# Altium schematic sheet USB-Debug.SchDoc
size A3; SheetNumber: 1; SheetTotal: 1; PageSetup: Record=PageOptions|CenterHorizontal=True|CenterVertical=True|PrintScale=0.97|XCorrection=1.00|YCorrection=1.00|PrintKind=1|BorderSize=5000000|LeftOffset=0|BottomOffset=0|Orientation=2|PaperLength=2970|PaperWidth=2100|Scale=100|PaperSource=7|PrintQuality=600|MediaType=1|DitherType=10|PaperKind=A4|PrintScaleMode=1
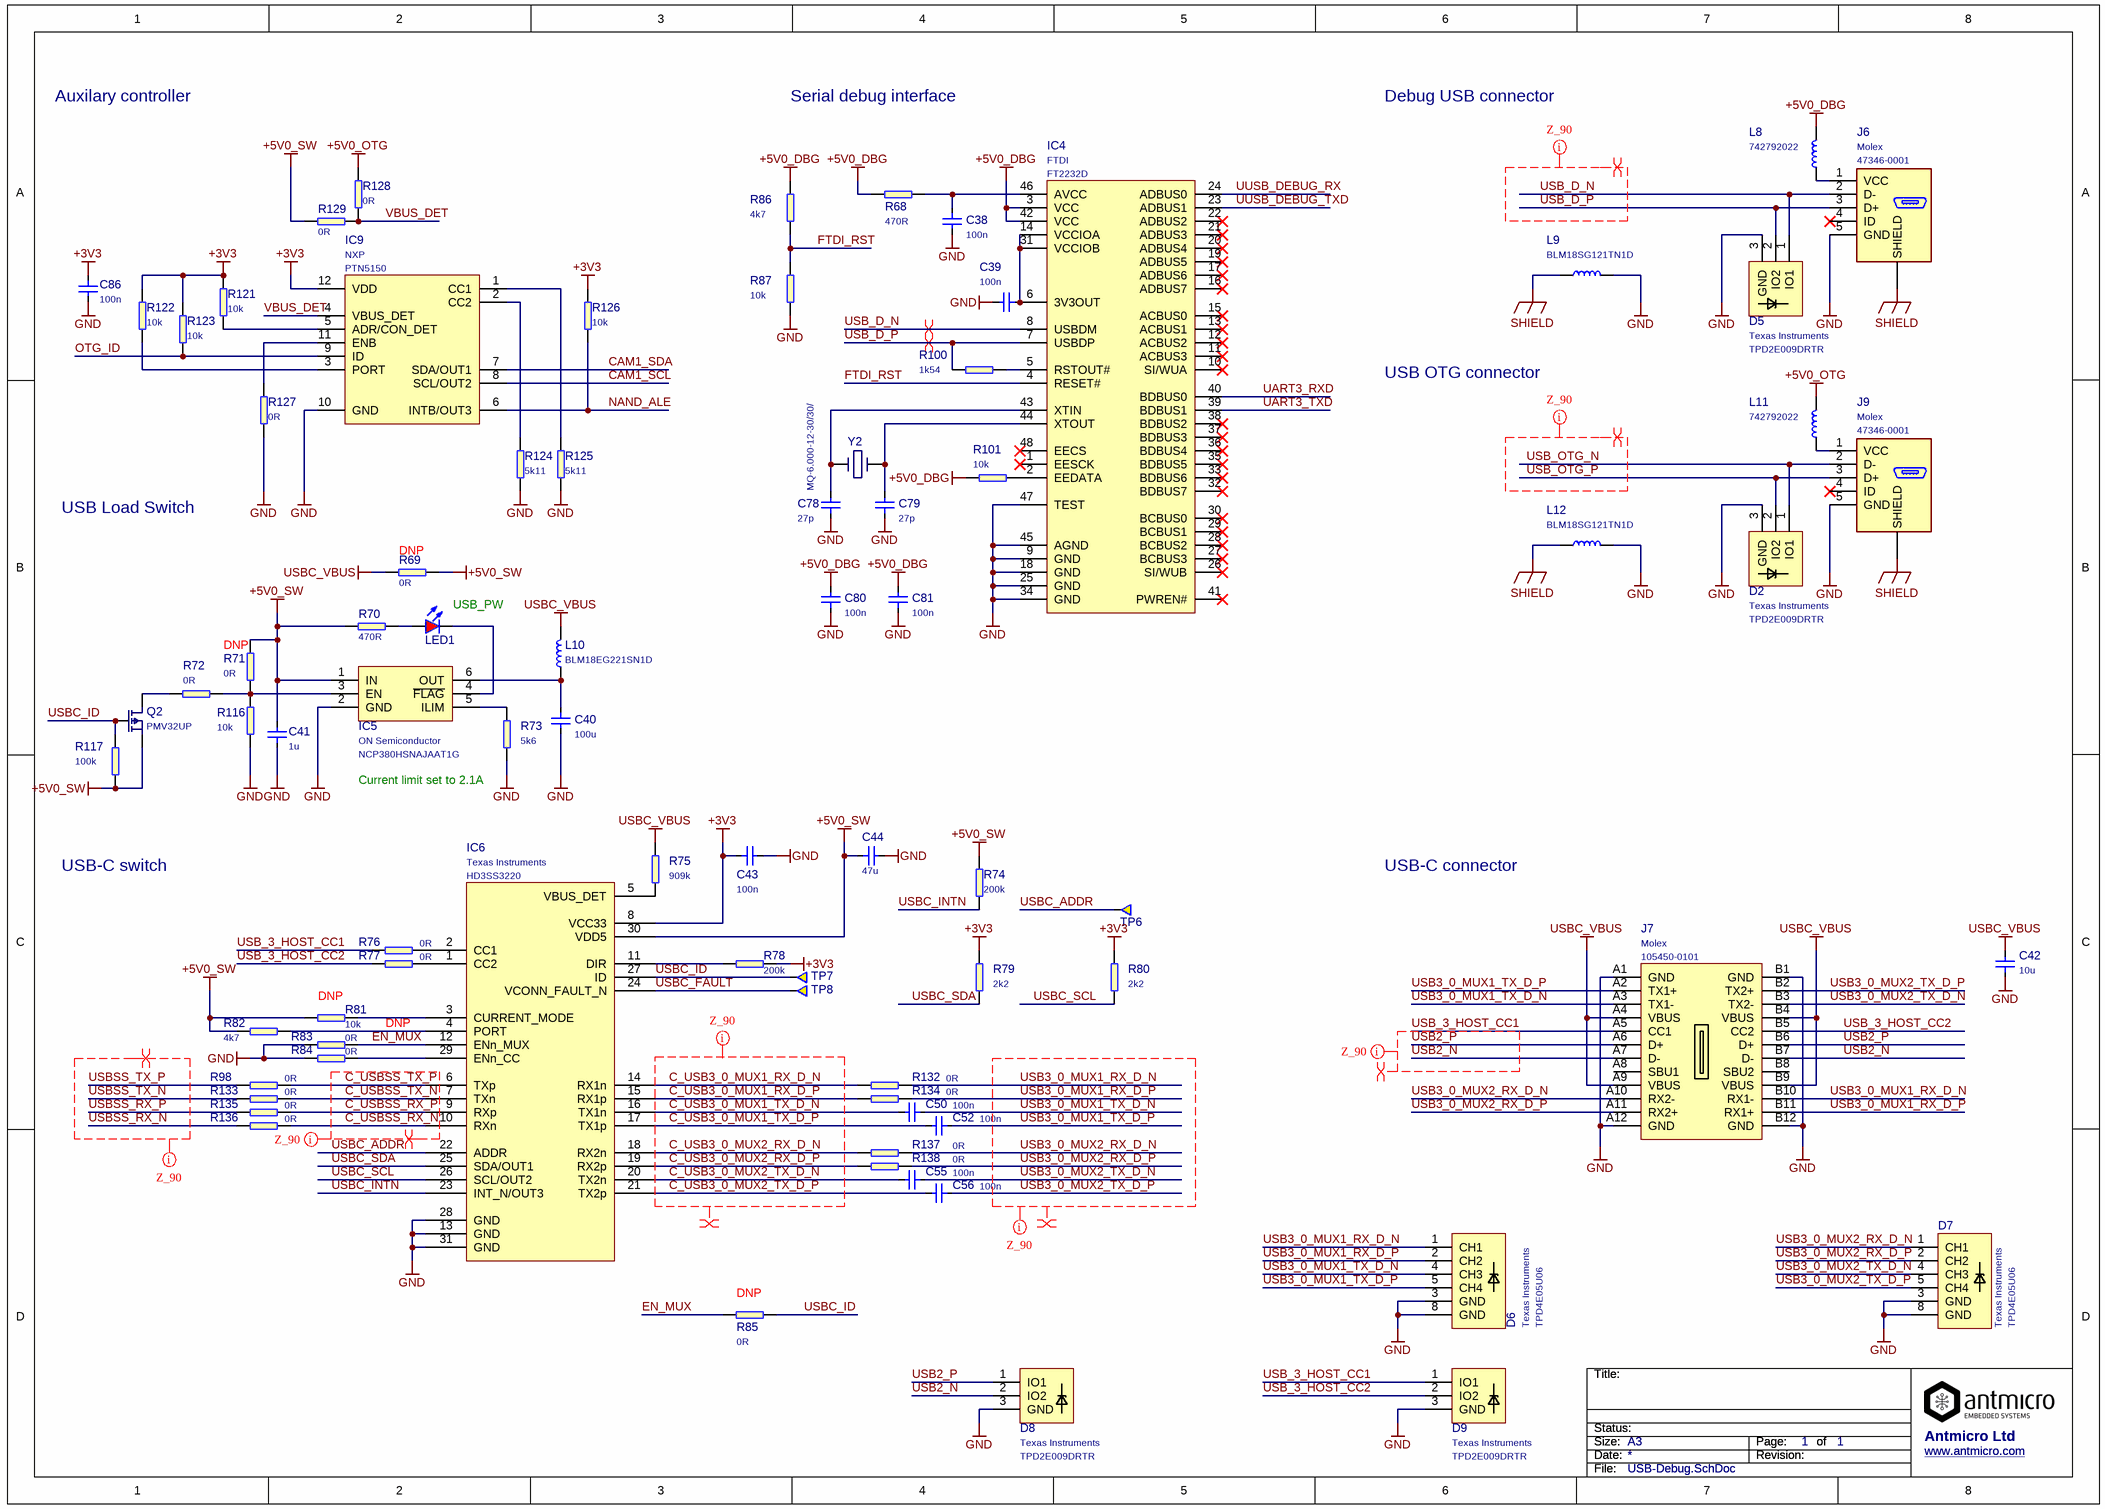
[diagram p0: USB-Debug.SchDoc]

## Parts
C38  100n  [C_0402]
C39  100n  [C_0402]
C40  100u  [1210]
C41  1u  [0603]
C42  10u  [0603]
C43  100n  [0603]
C44  47u  [0805]
C50  100n  [C_0402]
C52  100n  [C_0402]
C55  100n  [C_0402]
C56  100n  [C_0402]
C78  27p  [C_0402]
C79  27p  [C_0402]
C80  100n  [C_0402]
C81  100n  [C_0402]
C86  100n  [C_0402]
D2  TPD2E009DRTR  Manufacturer: Texas Instruments  [SOT-3]
D5  TPD2E009DRTR  Manufacturer: Texas Instruments  [SOT-3]
D6  Manufacturer: Texas Instruments  [TPD4E05U06_PASS]  (hidden comment: TPD4E05U06)
D7  Manufacturer: Texas Instruments  [TPD4E05U06_PASS]  (hidden comment: TPD4E05U06)
D8  TPD2E009DRTR  Manufacturer: Texas Instruments  [SOT-3]
D9  TPD2E009DRTR  Manufacturer: Texas Instruments  [SOT-3]
IC4  FT2232D  Manufacturer: FTDI  [LQFP-48]
IC5  NCP380HSNAJAAT1G  Manufacturer: ON Semiconductor  [TSOP-6]
IC6  HD3SS3220  Manufacturer: Texas Instruments  [RNH0030A]
IC9  PTN5150  Manufacturer: NXP  [PTN5150]
J6  Manufacturer: Molex  [CON-Molex-047346-0001]  (hidden comment: 47346-0001)
J7  105450-0101  Manufacturer: Molex  [CON-Molex-105450-0101]
J9  Manufacturer: Molex  [CON-Molex-047346-0001]  (hidden comment: 47346-0001)
L8  742792022  [0805]
L9  BLM18SG121TN1D  [0603]
L10  BLM18EG221SN1D  [0603]
L11  742792022  [0805]
L12  BLM18SG121TN1D  [0603]
LED1  KPT-1608EC  [LED0603]  (value not drawn)
Q2  PMV32UP  [SOT-23]
R68  470R  [0402]
R69  0R  [0603]
R70  470R  [0603]
R71  0R  [0402]
R72  0R  [0402]
R73  5k6  [0603]
R74  200k  [0402]
R75  909k  [0402]
R76  0R  [0402]
R77  0R  [0402]
R78  200k  [0402]
R79  2k2  [0402]
R80  2k2  [0402]
R81  10k  [0402]
R82  4k7  [0402]
R83  0R  [0402]
R84  0R  [0402]
R85  0R  [0402]
R86  4k7  [0402]
R87  10k  [0402]
R98  0R  [0402]
R100  1k54  [0402]
R101  10k  [0402]
R116  10k  [0402]
R117  100k  [0402]
R121  10k  [0402]
R122  10k  [0402]
R123  10k  [0402]
R124  5k11  [0402]
R125  5k11  [0402]
R126  10k  [0402]
R127  0R  [0402]
R128  0R  [0402]
R129  0R  [0402]
R132  0R  [0402]
R133  0R  [0402]
R134  0R  [0402]
R135  0R  [0402]
R136  0R  [0402]
R137  0R  [0402]
R138  0R  [0402]
TP6  Testpad  [TP-R-1.5]  (value not drawn)  (no BOM)
TP7  Testpad  [TP-R-1.5]  (value not drawn)  (no BOM)
TP8  Testpad  [TP-R-1.5]  (value not drawn)  (no BOM)
Y2  MQ-6.000-12-30/30/  [Crystal_5x7mm]

## Nets
+3V3: C43.1 C86.1 IC6.8(VCC33) IC9.12(VDD) R78.2 R79.2 R80.2 R121.2 R122.2 R123.2 R126.2
+5V0_DBG: C80.2 C81.2 IC4.3(VCC) IC4.42(VCC) L8.2 R68.1 R86.2 R101.1
+5V0_OTG: L11.2 R128.2
+5V0_SW: C41.2 C44.1 IC5.1(IN) IC6.30(VDD5) Q2.2(S) R69.2 R70.2 R71.2 R74.2 R81.1 R82.1 R117.1 R129.2
GND: C38.2 C39.2 C40.2 C41.1 C42.1 C43.2 C44.2 C78.1 C79.1 C80.1 C81.1 C86.2 D2.3(GND) D5.3(GND) D6.3(GND) D6.8(GND) D7.3(GND) D7.8(GND) D8.3(GND) D9.3(GND) IC4.9(GND) IC4.18(GND) IC4.25(GND) IC4.34(GND) IC4.45(AGND) IC4.47(TEST) IC5.2(GND) IC6.13(GND) IC6.28(GND) IC6.31(GND) IC9.10(GND) J6.5(GND) J7.A1(GND) J7.A12(GND) J7.B1(GND) J7.B12(GND) J9.5(GND) L9.2 L12.2 R73.1 R83.1 R84.1 R87.1 R116.1 R124.1 R125.1 R127.1
SHIELD: J6.S(SHIELD) J9.S(SHIELD) L9.1 L12.1
USBC_VBUS: C42.2 J7.A4(VBUS) J7.A9(VBUS) J7.B4(VBUS) J7.B9(VBUS) L10.2 R69.1 R75.2
C_USB3_0_MUX1_RX_D_N: IC6.14(RX1n) R132.1
C_USB3_0_MUX1_RX_D_P: IC6.15(RX1p) R134.1
C_USB3_0_MUX1_TX_D_N: C50.2 IC6.16(TX1n)
C_USB3_0_MUX1_TX_D_P: C52.2 IC6.17(TX1p)
C_USB3_0_MUX2_RX_D_N: IC6.18(RX2n) R137.1
C_USB3_0_MUX2_RX_D_P: IC6.19(RX2p) R138.1
C_USB3_0_MUX2_TX_D_N: C55.2 IC6.20(TX2n)
C_USB3_0_MUX2_TX_D_P: C56.2 IC6.21(TX2p)
C_USBSS_RX_N: IC6.10(RXn) R136.2
C_USBSS_RX_P: IC6.9(RXp) R135.2
C_USBSS_TX_N: IC6.7(TXn) R133.2
C_USBSS_TX_P: IC6.6(TXp) R98.2
CAM1_SCL: IC9.8(SCL/OUT2)
CAM1_SDA: IC9.7(SDA/OUT1)
EN_MUX: IC6.12(ENn_MUX) R83.2 R85.1
FTDI_RST: IC4.4(RESET#) R86.1 R87.2
NAND_ALE: IC9.6(INTB/OUT3) R126.1
OTG_ID: IC9.9(ID) R123.1
UART3_RXD: IC4.40(BDBUS0)
UART3_TXD: IC4.39(BDBUS1)
USB2_N: D8.2(IO2) J7.A7(D-) J7.B7(D-)
USB2_P: D8.1(IO1) J7.A6(D+) J7.B6(D+)
USB3_0_MUX1_RX_D_N: D6.1(CH1) J7.B10(RX1-) R132.2
USB3_0_MUX1_RX_D_P: D6.2(CH2) J7.B11(RX1+) R134.2
USB3_0_MUX1_TX_D_N: C50.1 D6.4(CH3) J7.A3(TX1-)
USB3_0_MUX1_TX_D_P: C52.1 D6.5(CH4) J7.A2(TX1+)
USB3_0_MUX2_RX_D_N: D7.1(CH1) J7.A10(RX2-) R137.2
USB3_0_MUX2_RX_D_P: D7.2(CH2) J7.A11(RX2+) R138.2
USB3_0_MUX2_TX_D_N: C55.1 D7.4(CH3) J7.B3(TX2-)
USB3_0_MUX2_TX_D_P: C56.1 D7.5(CH4) J7.B2(TX2+)
USB_3_HOST_CC1: D9.1(IO1) J7.A5(CC1) R76.1
USB_3_HOST_CC2: D9.2(IO2) J7.B5(CC2) R77.1
USB_D_N: D5.1(IO1) IC4.8(USBDM) J6.2(D-)
USB_D_P: D5.2(IO2) IC4.7(USBDP) J6.3(D+) R100.1
USB_OTG_N: D2.1(IO1) J9.2(D-)
USB_OTG_P: D2.2(IO2) J9.3(D+)
USBC_ADDR: IC6.22(ADDR) TP6.1
USBC_FAULT: IC6.24(VCONN_FAULT_N) TP8.1
USBC_ID: IC6.27(ID) Q2.1(G) R85.2 R117.2 TP7.1
USBC_INTN: IC6.23(INT_N/OUT3) R74.1
USBC_SCL: IC6.26(SCL/OUT2) R80.1
USBC_SDA: IC6.25(SDA/OUT1) R79.1
USBSS_RX_N: R136.1
USBSS_RX_P: R135.1
USBSS_TX_N: R133.1
USBSS_TX_P: R98.1
UUSB_DEBUG_RX: IC4.24(ADBUS0)
UUSB_DEBUG_TXD: IC4.23(ADBUS1)
VBUS_DET: IC9.4(VBUS_DET) R128.1 R129.1
NetC38_1: C38.1 IC4.46(AVCC) R68.2
NetC39_1: C39.1 IC4.6(3V3OUT) IC4.14(VCCIOA) IC4.31(VCCIOB)
NetC40_1: C40.1 IC5.6(OUT) L10.1
NetC78_2: C78.2 IC4.43(XTIN) Y2.1
NetC79_2: C79.2 IC4.44(XTOUT) Y2.3
NetIC4_2: IC4.2(EEDATA) R101.2
NetIC4_5: IC4.5(RSTOUT#) R100.2
NetIC5_3: IC5.3(EN) R71.1 R72.2 R116.2
NetIC5_4: IC5.4(~{FLAG}) LED1.K
NetIC5_5: IC5.5(ILIM) R73.2
NetIC6_1: IC6.1(CC2) R77.2
NetIC6_2: IC6.2(CC1) R76.2
NetIC6_3: IC6.3(CURRENT_MODE) R81.2
NetIC6_4: IC6.4(PORT) R82.2
NetIC6_5: IC6.5(VBUS_DET) R75.1
NetIC6_11: IC6.11(DIR) R78.1
NetIC6_29: IC6.29(ENn_CC) R84.2
NetIC9_1: IC9.1(CC1) R125.2
NetIC9_2: IC9.2(CC2) R124.2
NetIC9_3: IC9.3(PORT) R122.1
NetIC9_5: IC9.5(ADR/CON_DET) R121.1
NetIC9_11: IC9.11(ENB) R127.2
NetJ6_1: J6.1(VCC) L8.1
NetJ9_1: J9.1(VCC) L11.1
NetLED1_A: LED1.A R70.1
NetQ2_3: Q2.3(D) R72.1

Not connected (* = marked no-connect by the designer): IC4 1(EESCK)* 10(SI/WUA)* 11(ACBUS3)* 12(ACBUS2)* 13(ACBUS1)* 15(ACBUS0)* 16(ADBUS7)* 17(ADBUS6)* 19(ADBUS5)* 20(ADBUS4)* 21(ADBUS3)* 22(ADBUS2)* 26(SI/WUB)* 27(BCBUS3)* 28(BCBUS2)* 29(BCBUS1)* 30(BCBUS0)* 32(BDBUS7)* 33(BDBUS6)* 35(BDBUS5)* 36(BDBUS4)* 37(BDBUS3)* 38(BDBUS2)* 41(PWREN#)* 48(EECS)*; J6 4(ID)*; J7 A8(SBU1) B8(SBU2); J9 4(ID)*

## Layout directives
differential pair: C_USB3_0_MUX1_RX_D_N, C_USB3_0_MUX1_RX_D_P, C_USB3_0_MUX1_TX_D_N, C_USB3_0_MUX1_TX_D_P, C_USB3_0_MUX2_RX_D_N, C_USB3_0_MUX2_RX_D_P, C_USB3_0_MUX2_TX_D_N, C_USB3_0_MUX2_TX_D_P, C_USBSS_RX_N, C_USBSS_RX_P, C_USBSS_TX_N, C_USBSS_TX_P, USB2_N, USB2_P, USB3_0_MUX1_RX_D_N, USB3_0_MUX1_RX_D_P, USB3_0_MUX1_TX_D_N, USB3_0_MUX1_TX_D_P, USB3_0_MUX2_RX_D_N, USB3_0_MUX2_RX_D_P, USB3_0_MUX2_TX_D_N, USB3_0_MUX2_TX_D_P, USB_3_HOST_CC1, USB_D_N, USB_D_P, USB_OTG_N, USB_OTG_P, USBSS_RX_N, USBSS_RX_P, USBSS_TX_N, USBSS_TX_P
net class Z_90: C_USB3_0_MUX1_RX_D_N, C_USB3_0_MUX1_RX_D_P, C_USB3_0_MUX1_TX_D_N, C_USB3_0_MUX1_TX_D_P, C_USB3_0_MUX2_RX_D_N, C_USB3_0_MUX2_RX_D_P, C_USB3_0_MUX2_TX_D_N, C_USB3_0_MUX2_TX_D_P, C_USBSS_RX_N, C_USBSS_RX_P, C_USBSS_TX_N, C_USBSS_TX_P, USB2_N, USB2_P, USB3_0_MUX1_RX_D_N, USB3_0_MUX1_RX_D_P, USB3_0_MUX1_TX_D_N, USB3_0_MUX1_TX_D_P, USB3_0_MUX2_RX_D_N, USB3_0_MUX2_RX_D_P, USB3_0_MUX2_TX_D_N, USB3_0_MUX2_TX_D_P, USB_3_HOST_CC1, USB_D_N, USB_D_P, USB_OTG_N, USB_OTG_P, USBSS_RX_N, USBSS_RX_P, USBSS_TX_N, USBSS_TX_P

## Notes on the sheet
- Auxilary controller
- Serial debug interface
- Debug USB connector
- USB OTG connector
- USB Load Switch
- (near R69) DNP
- (near R71) DNP
- (near LED1) USB_PW
- (near R73) Current limit set to 2.1A
- USB-C switch
- USB-C connector
- (near R81) DNP
- DNP
- (near R85) DNP
- Title:
- Size:
- Date:
- Status:
- A3
- Revision:
- Page:
- of
- Antmicro Ltd
- www.antmicro.com
- File:

## Library data of the parts
C38 C39 C50 C52 C55 C56 C80 C81 C86 = C_100n_0402: MLCC SMT Capacitor 100nF 0402; PartNumber: C_100n_0402; Value: 100n
C40 = C_100u_1210_X5R: MLCC SMT Capacitor 100uF 1210 X5R; Value: 100u; PartNumber: C_100u_1210_X5R
C41 = C_1u_0603: MLCC SMT Capacitor 1uF 0603; Value: 1u; PartNumber: C_1u_0603
C42 = C_10u_0603: MLCC SMT Capacitor 10uF 0603; PartNumber: C_10u_0603; Value: 10u
C43 = C_100n_0603: MLCC SMT Capacitor 100nF 0603; Manufacturer: AVX; PartNumber: C_100n_0603; Value: 100n
C44 = C_47u_0805: MLCC SMT Capacitor 47uF 0805; Manufacturer: KEMET; PartNumber: C_47u_0805; Value: 47u
C78 C79 = C_27p_0402: MLCC SMT Capacitor 27pF 0402; PartNumber: C_27p_0402; Value: 27p
D2 D5 D8 D9 = TPD2E009DRTR: ESD Suppressors 2-CH; Value: TPD2E009DRTR; PartNumber: TPD2E009DRTR
D6 D7 = TPD4E05U06_PASS: ESD Suppressors 4-CH; PartNumber: TPD4E05U06; Value: TPD4E05U06
IC4 = FT2232D: Dual USB-UART/FIFO; Value: FT2232D; PartNumber: FT2232D
IC5 = NCP380HSNAJAAT1G: POWER LOAD SWITCH, HIGH SIDE; PartNumber: NCP380HSNAJAAT1G; Value: NCP380HSNAJAAT1G
IC6 = HD3SS3220: IC DRP PORT CTLR USB-C 30WQFN; PartNumber: HD3SS3220; Value: HD3SS3220
IC9 = PTN5150: CC logic for USB Type-C applications; PartNumber: PTN5150; Value: PTN5150
J6 J9 = CON-Molex-47346-0001: USB - micro B Receptacle Connector 5 Position Surface Mount, Right Angle, Horizontal; PartNumber: 47346-0001; Value: 47346-0001
J7 = CON-Molex-105450-0101: USB-C connector; PartNumber: CON-Molex-105450-0101; Value: 105450-0101
L8 L11 = 742792022: WURTH ELEKTRONIK - 742792022 - FERRITE BEAD, 0.05OHM, 2A, 0805; Value: 742792022; Manufacturer: WURTH ELEKTRONIK; PartNumber: 742792022
L9 = BLM18SG121TN1D: FERRITE BEAD, 0.025OHM, 3A, 0603; Manufacturer: MURATA; PartNumber: BLM18EG221SN1D; Value: BLM18SG121TN1D
L10 = BLM18EG221SN1D: MURATA 	BLM18EG221SN1D  FERRITE BEAD, 0.05OHM, 2A, 0603; Value: BLM18EG221SN1D; Manufacturer: MURATA; PartNumber: BLM18EG221SN1D
L12 = BLM18SG121TN1D: FERRITE BEAD, 0.025OHM, 3A, 0603; Manufacturer: MURATA; Value: BLM18SG121TN1D; PartNumber: BLM18SG121TN1D
LED1 = LED_R: LED Red 0603 case; Manufacturer: KINGBRIGHT; Value: KPT-1608EC; PartNumber: KPT-1608EC
Q2 = PMV32UP: P CH, 20V, 4A; Manufacturer: NXP; PartNumber: PMV32UP; Value: PMV32UP
R68 = R_470R_0402: SMT Resistor 470R 0402; PartNumber: R_470R_0402; Value: 470R
R69 = R_0R_0603: SMT Resistor 0R 0603; Value: 0R; PartNumber: R_0R_0603
R70 = R_470R_0603: SMT Resistor 470R 0603; Value: 470R; PartNumber: R_470R_0603
R71 R72 R76 R77 R83-R85 R98 R127-R129 R132-R138 = R_0R_0402: SMT Resistor 0402; PartNumber: R_0R_0402; Value: 0R
R73 = R_5k6_0603: SMT Resistor 5k6 0603; PartNumber: R_5k6_0603; Value: 5k6
R74 R78 = R_200k_0402: SMT Resistor 200k 0402; PartNumber: R_200k_0402; Value: 200k
R75 = R_909k_0402: SMT Resistor 9k31 0402; PartNumber: R_909k_0402; Value: 909k
R79 R80 = R_2k2_0402: RES, 2k2, 0402, 5%; PartNumber: R_2k2_0402; Value: 2k2
R81 R87 R101 R116 R121-R123 R126 = R_10k_0402: SMT Resistor 0402; PartNumber: R_10k_0402; Value: 10k
R82 R86 = R_4k7_0402: SMT Resistor 4k7 0402; PartNumber: R_4k7_0402; Value: 4k7
R100 = R_1k54_0402: SMT Resistor 1k54 0402; PartNumber: R_1k54_0402; Value: 1k54
R117 = R_100k_0402: SMT Resistor 100k 0402; PartNumber: R_100k_0402; Value: 100k
R124 R125 = R_5k11_0402: SMT Resistor 5k11 0402; PartNumber: R_5k11_0402; Value: 5k11
TP6-TP8 = TP-R-1.5: Testpad, round, 1.5mm; PartNumber: Testpad
Y2 = CRYSTAL_6_MHz_SMD: CRYSTAL, 6MHZ, 12PF, SMD,30ppm; Manufacturer: MERCURY UNITED ELECTRONICS; Value: MQ-6.000-12-30/30/; PartNumber: CRYSTAL_6_MHz_SMD